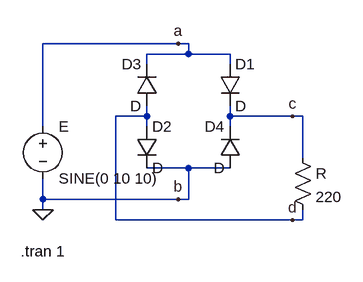
[diagram p0: schematic Draft9.asc]
Draft9.asc, the LTspice schematic file:
Version 4
SHEET 1 880 680
WIRE 256 0 48 0
WIRE 272 0 256 0
WIRE 272 16 272 0
WIRE 272 16 208 16
WIRE 336 16 272 16
WIRE 208 32 208 16
WIRE 336 32 336 16
WIRE 208 112 208 96
WIRE 208 112 160 112
WIRE 336 112 336 96
WIRE 432 112 336 112
WIRE 448 112 432 112
WIRE 48 128 48 0
WIRE 208 128 208 112
WIRE 336 128 336 112
WIRE 448 176 448 112
WIRE 272 192 208 192
WIRE 336 192 272 192
WIRE 48 240 48 208
WIRE 256 240 48 240
WIRE 272 240 272 192
WIRE 272 240 256 240
WIRE 48 256 48 240
WIRE 160 272 160 112
WIRE 432 272 160 272
WIRE 448 272 448 256
WIRE 448 272 432 272
FLAG 48 256 0
FLAG 256 0 a
FLAG 432 112 c
FLAG 432 272 d
FLAG 256 240 b
SYMBOL voltage 48 112 R0
WINDOW 123 0 0 Left 0
WINDOW 39 0 0 Left 0
SYMATTR InstName E
SYMATTR Value SINE(0 10 10)
SYMBOL diode 320 32 R0
SYMATTR InstName D1
SYMBOL diode 192 128 R0
SYMATTR InstName D2
SYMBOL diode 224 96 R180
WINDOW 0 24 64 Left 2
WINDOW 3 24 0 Left 2
SYMATTR InstName D3
SYMBOL diode 352 192 R180
WINDOW 0 24 64 Left 2
WINDOW 3 24 0 Left 2
SYMATTR InstName D4
SYMBOL res 432 160 R0
SYMATTR InstName R
SYMATTR Value 220
SYMATTR SpiceLine tol=1 pwr=0.1
TEXT 14 320 Left 2 !.tran 1

The netlist it stands for:
* Draft9.asc
V§E a 0 SINE(0 10 10)
D1 a c D
D2 d 0 D
D3 d a D
D4 0 c D
R c d 220 tol=1 pwr=0.1
.model D D
.lib standard.dio
.tran 1
.backanno
.end

* Results of the author's LTspice run, read from the files saved beside the schematic
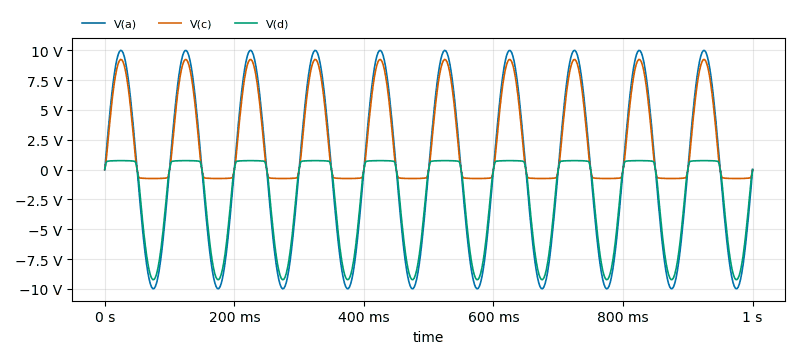
[diagram p1: Transient Analysis of Draft9.asc, plotted from the saved traces]
* Transient Analysis, 1 run:
*   V(a): min -9.995 V, max 9.995 V, average 0 V, rms 7.069 V, last 0 V
*   V(c): min -749.6 mV, max 9.236 V, average 2.482 V, rms 4.556 V, last 0 V
*   V(d): min -9.236 V, max 749.6 mV, average -2.482 V, rms 4.556 V, last 0 V